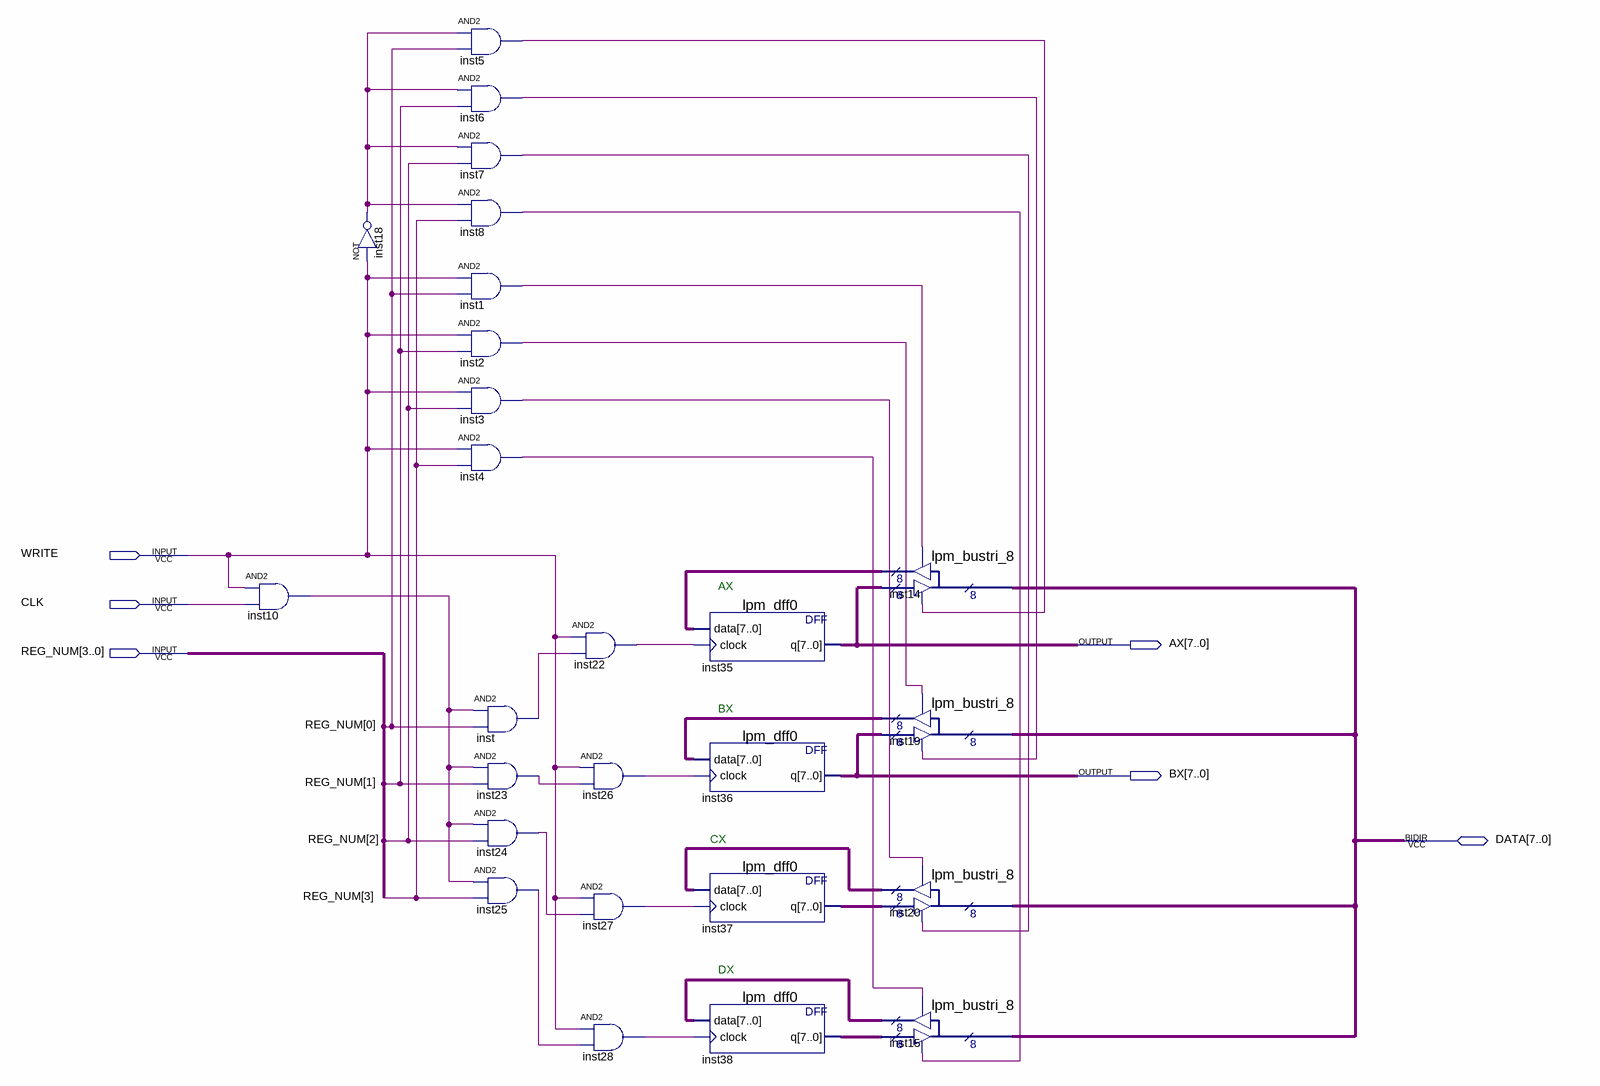
[diagram p0: schematic sheet]
// Quartus schematic RON.bdf as structural Verilog: 26 symbols, 6 pins
module RON (
  input  WRITE,
  input  CLK,
  input  [3:0] REG_NUM,
  inout  [7:0] DATA,
  output [7:0] AX,
  output [7:0] BX
);

  wire inst1_out, inst2_out, inst3_out, inst4_out, inst5_out, inst6_out, inst7_out, inst8_out, inst10_out,
       inst18_out, inst22_out, inst23_out, inst24_out, inst25_out, inst26_out, inst27_out, inst28_out,
       inst_out;
  wire [7:0] inst14_result, inst15_result, inst19_result, inst20_result, inst37_q, inst38_q;

  and inst10 (inst10_out, WRITE, CLK);
  not inst18 (inst18_out, WRITE);
  and inst5 (inst5_out, inst18_out, REG_NUM[0]);
  and inst6 (inst6_out, inst18_out, REG_NUM[1]);
  and inst7 (inst7_out, inst18_out, REG_NUM[2]);
  and inst8 (inst8_out, inst18_out, REG_NUM[3]);
  and inst1 (inst1_out, WRITE, REG_NUM[0]);
  and inst2 (inst2_out, WRITE, REG_NUM[1]);
  and inst3 (inst3_out, WRITE, REG_NUM[2]);
  and inst4 (inst4_out, WRITE, REG_NUM[3]);
  and inst (inst_out, inst10_out, REG_NUM[0]);
  and inst23 (inst23_out, inst10_out, REG_NUM[1]);
  and inst24 (inst24_out, inst10_out, REG_NUM[2]);
  and inst25 (inst25_out, inst10_out, REG_NUM[3]);
  and inst22 (inst22_out, WRITE, inst_out);
  and inst26 (inst26_out, WRITE, inst23_out);
  and inst27 (inst27_out, WRITE, inst24_out);
  and inst28 (inst28_out, WRITE, inst25_out);
  lpm_dff0 inst35 (.data(inst14_result), .clock(inst22_out), .q(AX));
  lpm_dff0 inst36 (.data(inst19_result), .clock(inst26_out), .q(BX));
  lpm_dff0 inst37 (.data(inst20_result), .clock(inst27_out), .q(inst37_q));
  lpm_dff0 inst38 (.data(inst15_result), .clock(inst28_out), .q(inst38_q));
  lpm_bustri_8 inst14 (.enabledt(inst5_out), .data(AX), .enabletr(inst1_out), .result(inst14_result), .tridata(DATA));
  lpm_bustri_8 inst19 (.enabledt(inst6_out), .data(BX), .enabletr(inst2_out), .result(inst19_result), .tridata(DATA));
  lpm_bustri_8 inst20 (
    .enabledt(inst7_out), .data(inst37_q), .enabletr(inst3_out), .result(inst20_result), .tridata(DATA));
  lpm_bustri_8 inst15 (
    .enabledt(inst8_out), .data(inst38_q), .enabletr(inst4_out), .result(inst15_result), .tridata(DATA));

  // Notes on the sheet:
  //   AX
  //   BX
  //   CX
  //   DX
endmodule
